# Altium schematic sheet motors-state-monitor.SchDoc
size A4; DrawnBy: Lorna Lan, Dylan Vogel; DocumentNumber: 13; Revision: v4.2; SheetNumber: 13; SheetTotal: 20
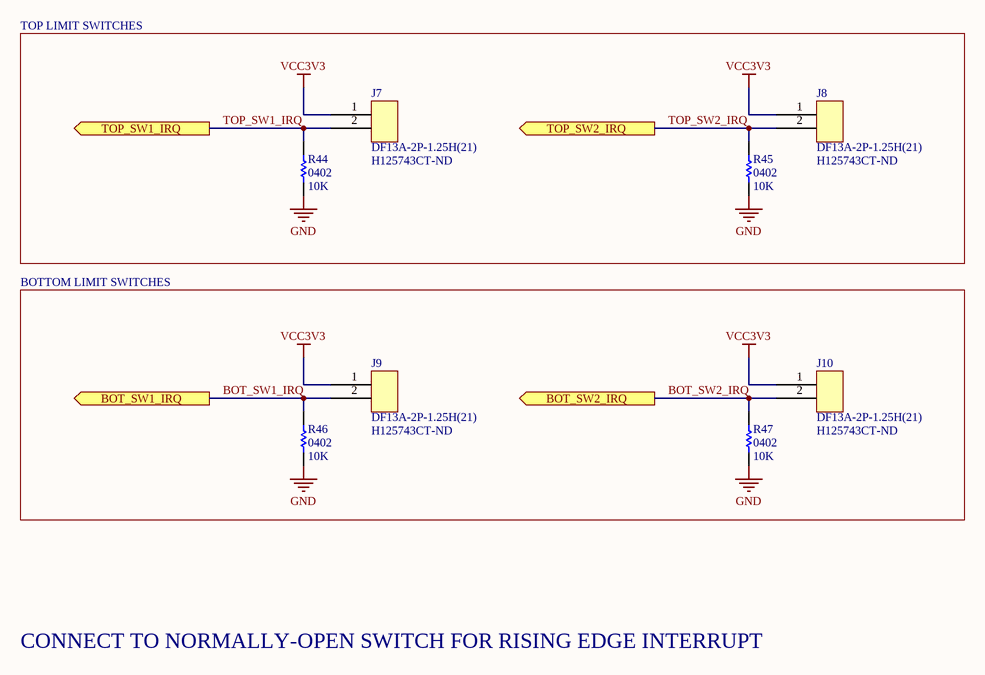
[diagram p0: motors-state-monitor.SchDoc]

## Parts
J7  DF13A-2P-1.25H(21)  Supplier Part Number 1: H125743CT-ND  [DF13A-2P-1.25H(21)]
J8  DF13A-2P-1.25H(21)  Supplier Part Number 1: H125743CT-ND  [DF13A-2P-1.25H(21)]
J9  DF13A-2P-1.25H(21)  Supplier Part Number 1: H125743CT-ND  [DF13A-2P-1.25H(21)]
J10  DF13A-2P-1.25H(21)  Supplier Part Number 1: H125743CT-ND  [DF13A-2P-1.25H(21)]
R44  0402  value 10K  [RES0402R]
R45  0402  value 10K  [RES0402R]
R46  0402  value 10K  [RES0402R]
R47  0402  value 10K  [RES0402R]

## Blocks framed on the sheet
TOP LIMIT SWITCHES: J7 J8 R44 R45
BOTTOM LIMIT SWITCHES: J9 J10 R46 R47

## Ports
BOT_SW1_IRQ (out), BOT_SW2_IRQ (out), TOP_SW1_IRQ (out), TOP_SW2_IRQ (out)

## Nets
GND: R44.1 R45.1 R46.1 R47.1
VCC3V3: J7.1 J8.1 J9.1 J10.1
BOT_SW1_IRQ: J9.2 R46.2 ; port BOT_SW1_IRQ
BOT_SW2_IRQ: J10.2 R47.2 ; port BOT_SW2_IRQ
TOP_SW1_IRQ: J7.2 R44.2 ; port TOP_SW1_IRQ
TOP_SW2_IRQ: J8.2 R45.2 ; port TOP_SW2_IRQ

## Notes on the sheet
- CONNECT TO NORMALLY-OPEN SWITCH FOR RISING EDGE INTERRUPT

## Library data of the parts
J7-J10 = DF13A-2P-1.25H(21): 2 pos DF13 right angle surface mount connector; Supplier 1: Digi-Key
R44-R47 = RES0402: 0402 resistor; Manufacturer: Panasonic; Manufacturer Part Number: ERJ-2RKF1002X; Resistance: 10kR; Power Rating: 100mW; Tolerance: 1%; Voltage Rating: 50V; Temperature Coefficient: 100ppm/°C; Supplier 1: Digi-Key; Supplier Part Number 1: P10.0KLCT-ND; Stock 1: 14350001; Pricing 1: 1=0.1, 10=0.045, 100=0.0183, 1000=0.00823, 2500=0.00715, 5000=0.0059 (USD); Mount: Surface Mount; Case/Package: 0402; Number of Pins: 2; Case Code (Metric): 1005; Case Code (Imperial): 0402; Contact Plating: Tin; Min Operating Temperature: -55°C; Max Operating Temperature: 155°C; Packaging: Tape and Reel; Package Quantity: 1; Composition: Thick Film; Number of Terminations: 2; Termination: SMD/SMT; Military Standard: Not; Max Power Dissipation: 100mW; Voltage Rating (DC): 50V; Features: Automotive AEC-Q200; Length: 1mm; Height: 0.35mm; Width: 0.02inch; Depth: 0.5mm; Radiation Hardening: No; REACH SVHC: No SVHC; Lead Free: Lead Free; ComponentLink1URL: http://industrial.panasonic.com/www-data/pdf/AOA0000/AOA0000CE2.pdf?src-supplier=Future+Electronics; ComponentLink1Description: http://industrial.panasonic.com/www-data/pdf/AOA0000/AOA0000CE2.pdf?src-supplier=Future+Electronics; ComponentLink2URL: http://industrial.panasonic.com/www-data/pdf/AOA0000/AOA0000CE2.pdf?src-supplier=Avnet+Europe; ComponentLink2Description: http://industrial.panasonic.com/www-data/pdf/AOA0000/AOA0000CE2.pdf?src-supplier=Avnet+Europe; ComponentLink3URL: https://industrial.panasonic.com/cdbs/www-data/pdf/RDA0000/DMA0000COL11.pdf?src-supplier=Mouser; ComponentLink3Description: https://industrial.panasonic.com/cdbs/www-data/pdf/RDA0000/DMA0000COL11.pdf?src-supplier=Mouser; ComponentLink4URL: http://www.farnell.com/datasheets/1678782.pdf?src-supplier=Element14; ComponentLink4Description: http://www.farnell.com/datasheets/1678782.pdf?src-supplier=Element14; ComponentLink5URL: http://www.farnell.com/datasheets/1911175.pdf?src-supplier=Farnell; ComponentLink5Description: http://www.farnell.com/datasheets/1911175.pdf?src-supplier=Farnell; ComponentLink6URL: http://www.jameco.com/Jameco/Products/ProdDS/1987020.pdf?src-supplier=Jameco; ComponentLink6Description: http://www.jameco.com/Jameco/Products/ProdDS/1987020.pdf?src-supplier=Jameco; ComponentLink7URL: http://industrial.panasonic.com/www-data/pdf/AOA0000/AOA0000CE2.pdf?src-supplier=Avnet; ComponentLink7Description: http://industrial.panasonic.com/www-data/pdf/AOA0000/AOA0000CE2.pdf?src-supplier=Avnet; ComponentLink8URL: http://www.alliedelec.com/m/d/623f45ff1957d936ff56d46fd1c28cac.pdf?src-supplier=Allied+Electronics; ComponentLink8Description: http://www.alliedelec.com/m/d/623f45ff1957d936ff56d46fd1c28cac.pdf?src-supplier=Allied+Electronics